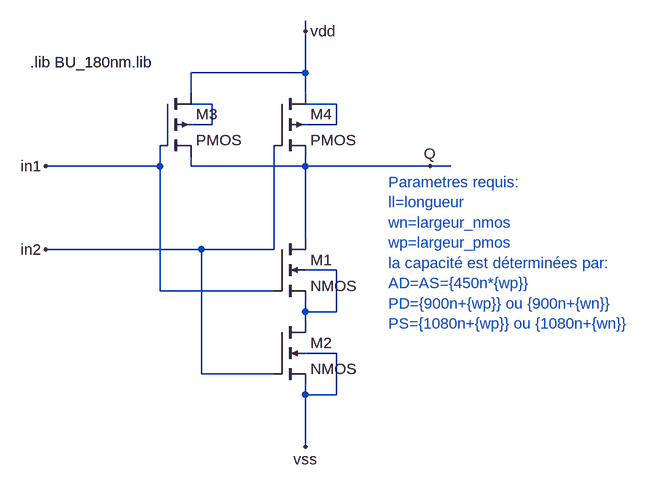
[diagram p0: schematic nand.asc]
nand.asc, the LTspice schematic file:
Version 4
SHEET 1 1192 980
WIRE 448 160 448 144
WIRE 448 224 448 160
WIRE 448 224 272 224
WIRE 272 256 272 224
WIRE 448 256 448 224
WIRE 304 272 272 272
WIRE 496 272 448 272
WIRE 304 304 304 272
WIRE 304 304 272 304
WIRE 496 304 496 272
WIRE 496 304 448 304
WIRE 224 368 224 336
WIRE 224 368 48 368
WIRE 272 368 272 352
WIRE 448 368 448 352
WIRE 448 368 272 368
WIRE 640 368 448 368
WIRE 672 368 640 368
WIRE 448 480 448 368
WIRE 288 496 48 496
WIRE 400 496 400 336
WIRE 400 496 288 496
WIRE 496 528 448 528
WIRE 224 560 224 368
WIRE 400 560 224 560
WIRE 448 592 448 576
WIRE 496 592 496 528
WIRE 496 592 448 592
WIRE 448 608 448 592
WIRE 496 656 448 656
WIRE 288 688 288 496
WIRE 400 688 288 688
WIRE 448 720 448 704
WIRE 496 720 496 656
WIRE 496 720 448 720
WIRE 448 800 448 720
FLAG 448 160 vdd
FLAG 448 800 vss
FLAG 640 368 Q
FLAG 48 368 in1
FLAG 48 496 in2
SYMBOL nmos4 400 480 R0
SYMATTR InstName M1
SYMATTR Value2 l={ll} w={wn} ad={450n*{wn}} as={450n*{wn}} pd={900n+{wn}} ps={1080n+{wn}}
SYMBOL nmos4 400 608 R0
SYMATTR InstName M2
SYMATTR Value2 l={ll} w={wn} ad={450n*{wn}} as={450n*{wn}} pd={900n+{wn}} ps={1080n+{wn}}
SYMBOL pmos4 224 256 R0
SYMATTR InstName M3
SYMATTR Value2 l={ll} w={wp} ad={450n*{wp}} as={450n*{wp}} pd={900n+{wp}} ps={1080n+{wp}}
SYMBOL pmos4 400 256 R0
SYMATTR InstName M4
SYMATTR Value2 l={ll} w={wp} ad={450n*{wp}} as={450n*{wp}} pd={900n+{wp}} ps={1080n+{wp}}
TEXT 24 208 Left 2 !.lib BU_180nm.lib
TEXT 576 392 Left 2 ;Parametres requis: \nll=longueur \nwn=largeur_nmos \nwp=largeur_pmos\nla capacité est déterminées par:     \nAD=AS={450n*{wp}}\nPD={900n+{wp}} ou {900n+{wn}}\nPS={1080n+{wp}} ou {1080n+{wn}}

The netlist it stands for:
* nand.asc
M1 Q in1 N003 N003 NMOS l={ll} w={wn} ad={450n*{wn}} as={450n*{wn}} pd={900n+{wn}} ps={1080n+{wn}}
M2 N003 in2 vss vss NMOS l={ll} w={wn} ad={450n*{wn}} as={450n*{wn}} pd={900n+{wn}} ps={1080n+{wn}}
M3 vdd in1 Q N001 PMOS l={ll} w={wp} ad={450n*{wp}} as={450n*{wp}} pd={900n+{wp}} ps={1080n+{wp}}
M4 vdd in2 Q N002 PMOS l={ll} w={wp} ad={450n*{wp}} as={450n*{wp}} pd={900n+{wp}} ps={1080n+{wp}}
.model NMOS NMOS
.model PMOS PMOS
.lib standard.mos
.lib BU_180nm.lib
* Parametres requis:
* ll=longueur
* wn=largeur_nmos
* wp=largeur_pmos
* la capacité est déterminées par:
* AD=AS={450n*{wp}}
* PD={900n+{wp}} ou {900n+{wn}}
* PS={1080n+{wp}} ou {1080n+{wn}}
.backanno
.end